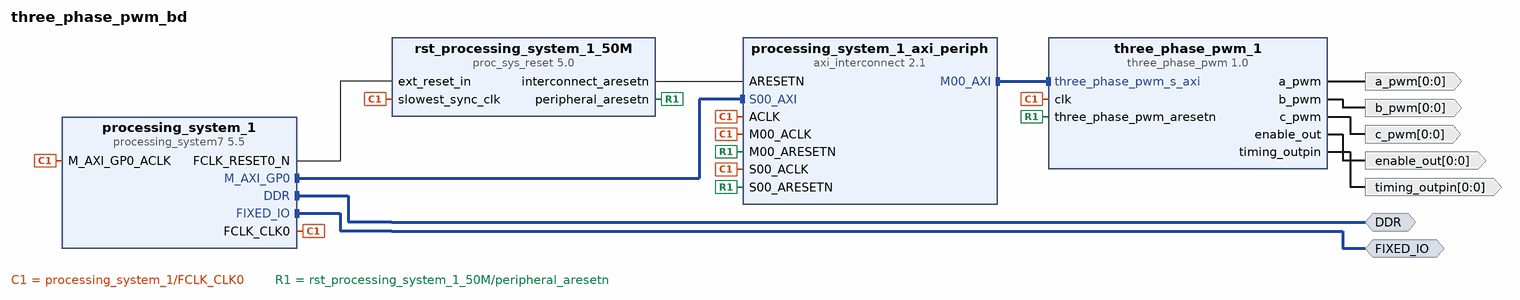
[diagram p0: block diagram of the top level]
# Vivado block design three_phase_pwm_bd, Vivado 2015.4
create_bd_design three_phase_pwm_bd

create_bd_intf_port -mode Master -vlnv xilinx.com:interface:ddrx_rtl:1.0 DDR
create_bd_intf_port -mode Master -vlnv xilinx.com:display_processing_system7:fixedio_rtl:1.0 FIXED_IO
create_bd_port -dir O -from 0 -to 0 -type data a_pwm
create_bd_port -dir O -from 0 -to 0 -type data b_pwm
create_bd_port -dir O -from 0 -to 0 -type data c_pwm
create_bd_port -dir O -from 0 -to 0 -type data enable_out
create_bd_port -dir O -from 0 -to 0 -type data timing_outpin

create_bd_cell -type ip -vlnv User_Company:SysGen:three_phase_pwm:1.0 three_phase_pwm_1
create_bd_cell -type ip -vlnv xilinx.com:ip:processing_system7:5.5 processing_system_1
# 2 more settings of processing_system_1 are not shown: defaults, MIO pin electricals, DDR timing, and values the tool derives
create_bd_cell -type ip -vlnv xilinx.com:ip:axi_interconnect:2.1 processing_system_1_axi_periph
set_property -dict {CONFIG.NUM_MI 1} [get_bd_cells processing_system_1_axi_periph]
create_bd_cell -type ip -vlnv xilinx.com:ip:proc_sys_reset:5.0 rst_processing_system_1_50M

# ---- connections ----

connect_bd_intf_net [get_bd_intf_pins processing_system_1/M_AXI_GP0] [get_bd_intf_pins processing_system_1_axi_periph/S00_AXI]
connect_bd_intf_net [get_bd_intf_pins processing_system_1_axi_periph/M00_AXI] [get_bd_intf_pins three_phase_pwm_1/three_phase_pwm_s_axi]
connect_bd_intf_net [get_bd_intf_ports DDR] [get_bd_intf_pins processing_system_1/DDR]
connect_bd_intf_net [get_bd_intf_ports FIXED_IO] [get_bd_intf_pins processing_system_1/FIXED_IO]
connect_bd_net [get_bd_pins processing_system_1/FCLK_CLK0] \
  [get_bd_pins processing_system_1/M_AXI_GP0_ACLK] [get_bd_pins processing_system_1_axi_periph/S00_ACLK] \
  [get_bd_pins rst_processing_system_1_50M/slowest_sync_clk] [get_bd_pins processing_system_1_axi_periph/ACLK] \
  [get_bd_pins three_phase_pwm_1/clk] [get_bd_pins processing_system_1_axi_periph/M00_ACLK]
connect_bd_net [get_bd_pins processing_system_1/FCLK_RESET0_N] [get_bd_pins rst_processing_system_1_50M/ext_reset_in]
connect_bd_net [get_bd_pins rst_processing_system_1_50M/peripheral_aresetn] \
  [get_bd_pins processing_system_1_axi_periph/S00_ARESETN] [get_bd_pins three_phase_pwm_1/three_phase_pwm_aresetn] \
  [get_bd_pins processing_system_1_axi_periph/M00_ARESETN]
connect_bd_net [get_bd_pins rst_processing_system_1_50M/interconnect_aresetn] [get_bd_pins processing_system_1_axi_periph/ARESETN]
connect_bd_net [get_bd_pins three_phase_pwm_1/a_pwm] [get_bd_ports a_pwm]
connect_bd_net [get_bd_pins three_phase_pwm_1/b_pwm] [get_bd_ports b_pwm]
connect_bd_net [get_bd_pins three_phase_pwm_1/c_pwm] [get_bd_ports c_pwm]
connect_bd_net [get_bd_pins three_phase_pwm_1/enable_out] [get_bd_ports enable_out]
connect_bd_net [get_bd_pins three_phase_pwm_1/timing_outpin] [get_bd_ports timing_outpin]

# ---- address map ----
assign_bd_address -offset 0x43C00000 -range 64K -target_address_space [get_bd_addr_spaces processing_system_1/Data] [get_bd_addr_segs three_phase_pwm_1/three_phase_pwm_s_axi/reg0]

validate_bd_design
save_bd_design
